# EAGLE schematic threshold_control_device (EAGLE 6.2)
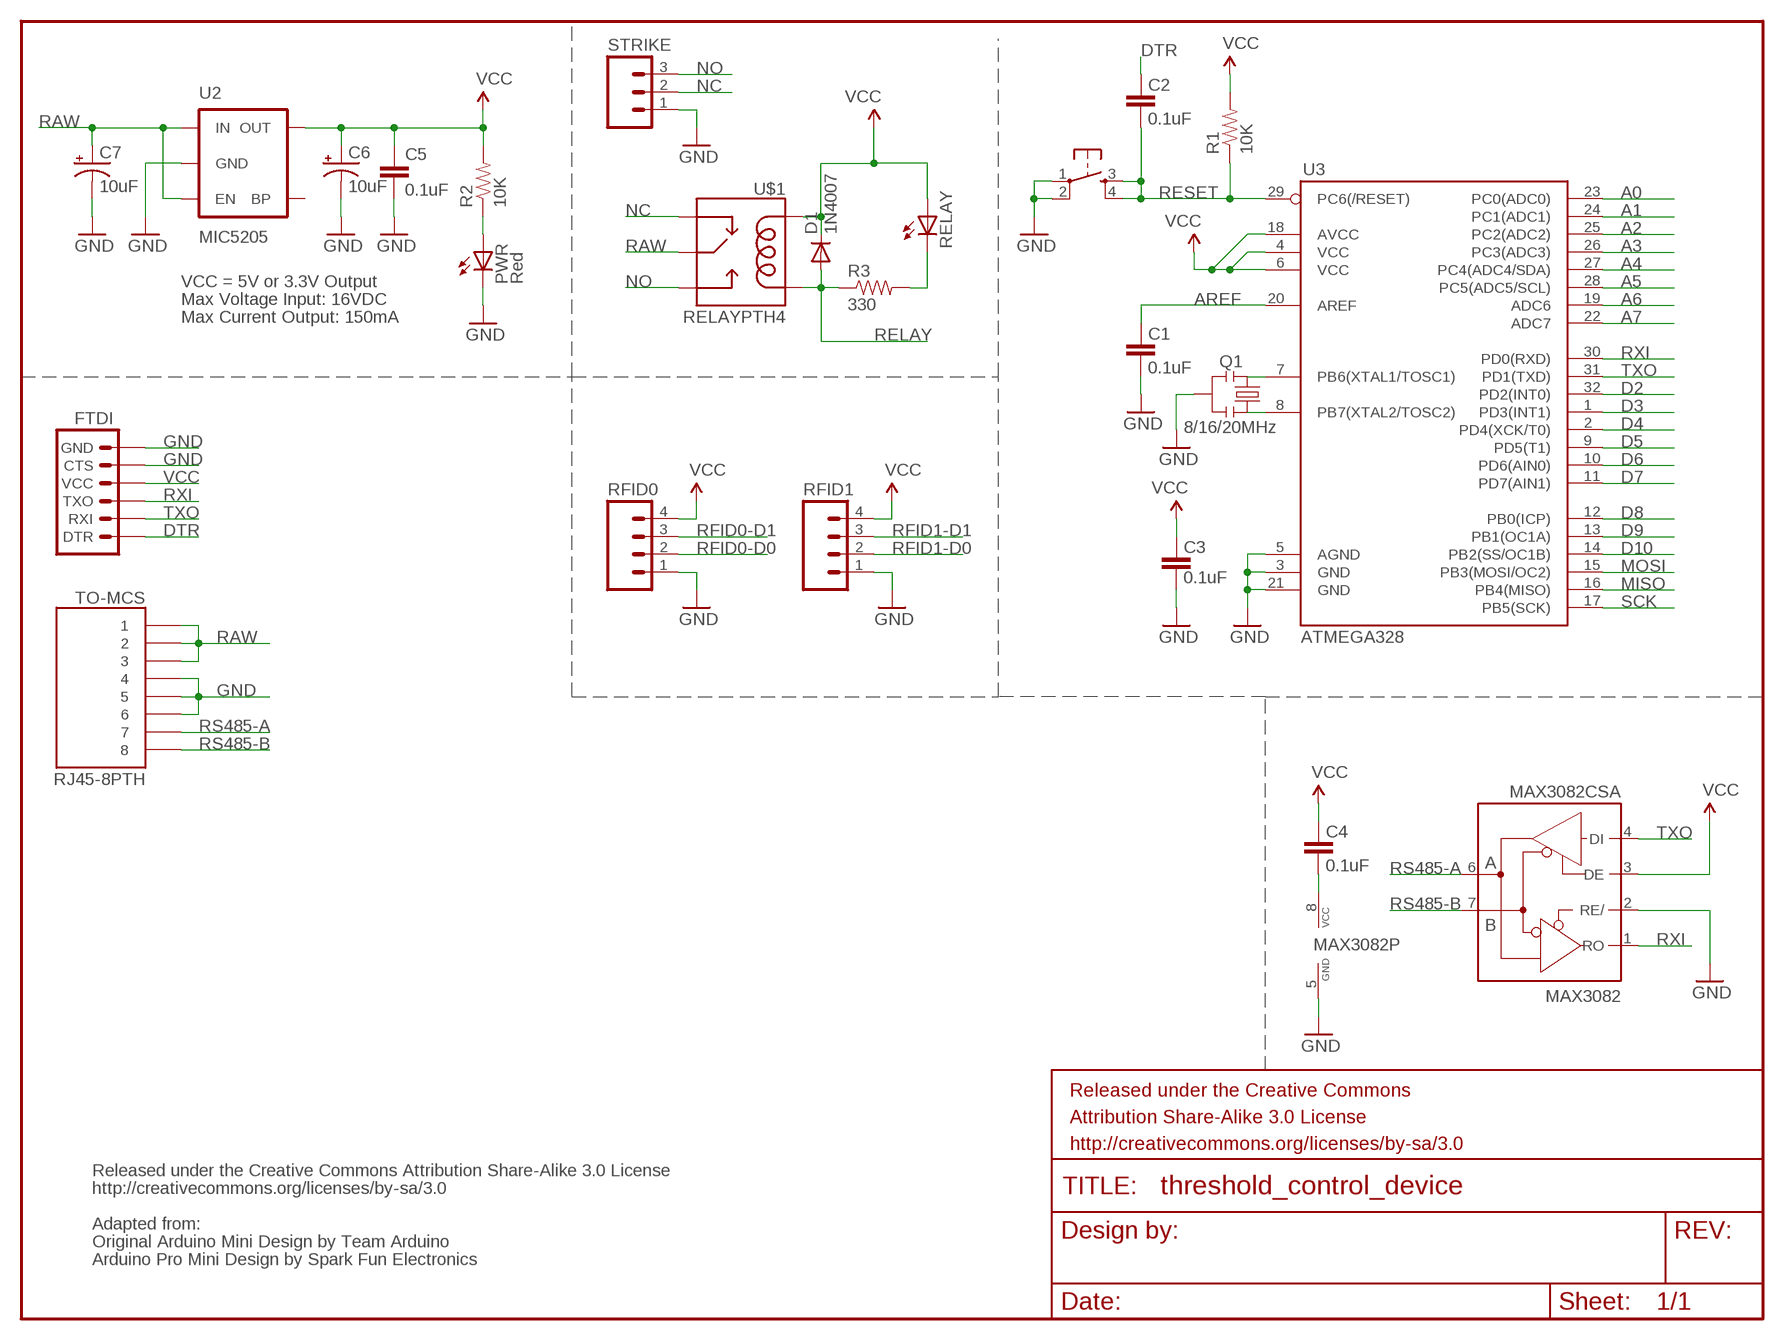
[diagram p0: schematic, sheet 1]

## Parts
C1  0.1uF  CAP0402-CAP  [0402-CAP]
C2  0.1uF  CAP0402-CAP  [0402-CAP]
C3  0.1uF  CAP0402-CAP  [0402-CAP]
C4  0.1uF  CAP0402-CAP  [0402-CAP]
C5  0.1uF  CAP0402-CAP  [0402-CAP]
C6  10uF  CAP_POL1206  [EIA3216]
C7  10uF  CAP_POL1206  [EIA3216]
D1  1N4007  DIODEPTH  [DIODE-1N4001]
FRAME1  FRAME-LETTER  [CREATIVE_COMMONS]
FTDI  ARDUINO_SERIAL_PROGRAMSMD  [1X06-SMD]
MAX3082  MAX3082CSA  MAX481CSA  [SO08]
PWR  Red  LED0603  [LED-0603]
Q1  8/16/20MHz  RESONATORSMD  [RESONATOR-SMD]
R1  10K  RESISTOR0402-RES  [0402-RES]
R2  10K  RESISTOR0402-RES  [0402-RES]
R3  330  RESISTORPTH-1/4W  [AXIAL-0.4]
RELAY  LED5MM  [LED5MM]
RESET  Reset  TAC_SWITCHSMD  [TACTILE_SWITCH_SMD]
RFID0  M04SCREW  [SCREWTERMINAL-3.5MM-4]
RFID1  M04SCREW  [SCREWTERMINAL-3.5MM-4]
STRIKE  M03SCREW  [SCREWTERMINAL-3.5MM-3]
TO-MCS  RJ45-8PTH  [RJ45-8]
U2  MIC5205  V_REG_LDOSMD  [SOT23-5]
U3  ATMEGA328  ATMEGA168  [TQFP32-08]
U$1  RELAYPTH4  [RELAY-JZC]

## Nets
A0: U3.23(PC0(ADC0))
A1: U3.24(PC1(ADC1))
A2: U3.25(PC2(ADC2))
A3: U3.26(PC3(ADC3))
A4: U3.27(PC4(ADC4/SDA))
A5: U3.28(PC5(ADC5/SCL))
A6: U3.19(ADC6)
A7: U3.22(ADC7)
AREF: C1.2 U3.20(AREF)
D2: U3.32(PD2(INT0))
D3: U3.1(PD3(INT1))
D4: U3.2(PD4(XCK/T0))
D5: U3.9(PD5(T1))
D6: U3.10(PD6(AIN0))
D7: U3.11(PD7(AIN1))
D8: U3.12(PB0(ICP))
D9: U3.13(PB1(OC1A))
D10: U3.14(PB2(SS/OC1B))
DTR: C2.2 FTDI.1(DTR)
GND [vcc]: C1.1 C3.1 C5.2 C6.C(-) C7.C(-) FTDI.5(CTS) FTDI.6(GND) MAX3082.2(RE/) MAX3082.5(GND) PWR.C Q1.2 RESET.1 RESET.2 RFID0.1 RFID1.1 STRIKE.1 TO-MCS.4 TO-MCS.5 TO-MCS.6 U2.2(GND) U3.3(GND) U3.5(AGND) U3.21(GND)
MISO: U3.16(PB4(MISO))
MOSI: U3.15(PB3(MOSI/OC2))
N$1: Q1.1 U3.8(PB7(XTAL2/TOSC2))
N$2: Q1.3 U3.7(PB6(XTAL1/TOSC1))
N$3: C4.1 MAX3082.8(VCC)
N$4: R3.P$2 RELAY.K(C)
N$38: PWR.A R2.1
NC: STRIKE.2 U$1.2(NC)
NO: STRIKE.3 U$1.3(NO)
RAW [vcc]: C7.A(+) TO-MCS.1 TO-MCS.2 TO-MCS.3 U2.1(IN) U2.3(EN) U$1.4(MAIN)
RELAY: D1.A R3.P$1 U$1.1(COIL2)
RESET: C2.1 R1.1 RESET.3 RESET.4 U3.29(PC6(/RESET))
RFID0-D0: RFID0.2
RFID0-D1: RFID0.3
RFID1-D0: RFID1.2
RFID1-D1: RFID1.3
RS485-A: MAX3082.6(A) TO-MCS.7
RS485-B: MAX3082.7(B) TO-MCS.8
RXI: FTDI.3(TXO) MAX3082.1(RO) U3.30(PD0(RXD))
SCK: U3.17(PB5(SCK))
TXO: FTDI.2(RXI) MAX3082.4(DI) U3.31(PD1(TXD))
VCC: C3.2 C4.2 C5.1 C6.A(+) D1.C FTDI.4(VCC) MAX3082.3(DE) R1.2 R2.2 RELAY.A RFID0.4 RFID1.4 U2.5(OUT) U3.4(VCC) U3.6(VCC) U3.18(AVCC) U$1.5(COIL1)
Unconnected: U2.4(BP)

## Notes on the sheet
- VCC = 5V or 3.3V Output
- Max Voltage Input: 16VDC
- Max Current Output: 150mA
- Released under the Creative Commons Attribution Share-Alike 3.0 License
- http://creativecommons.org/licenses/by-sa/3.0
- Adapted from:
- Original Arduino Mini Design by Team Arduino
- Arduino Pro Mini Design by Spark Fun Electronics

## Library data of the parts
C1-C5 = SparkFun:CAP: Capacitor Standard 0603 ceramic capacitor, and 0.1" leaded capacitor.
C6 C7 = SparkFun:CAP_POL: Capacitor Polarized These are standard SMD and PTH capacitors. Normally 10uF, 47uF, and 100uF in electrolytic and tantalum varieties. Always verify the external diameter of the through hole cap, it varies with capacity, voltage, and manufacturer. The EIA devices should be standard.
D1 = SparkFun:DIODE: Diode These are standard reverse protection diodes and small signal diodes. SMA package can handle up to about 1A. SOD-323 can handle about 200mA. What the SOD-323 package when ordering, there are some mfgs out there that are 5-pin packages.
FRAME1 = SparkFun-Aesthetics:FRAME-LETTER: Schematic Frame Standard 8.5x11 US Letter frame
FTDI = SparkFun-Connectors:ARDUINO_SERIAL_PROGRAM: FTDI connector footprints
MAX3082 = maxim:MAX481CSA: RS485 TRANSEIVER; MF: MAXIM; MPN: MAX481CSA; OC_FARNELL: unknown; OC_NEWARK: 90C3817
PWR RELAY = SparkFun:LED: LEDs Standard schematic elements and footprints for 5mm, 3mm, 1206, and 0603 sized LEDs. 5mm - Spark Fun Electronics SKU : COM-00529 (and others)
Q1 = SparkFun:RESONATOR: Resonator Small SMD resonator. This is the itty bitty 10/20MHz resonators with built in caps. CSTCE10M0G55 and CSTCE20M0V53. Footprint has been reviewed closely but hasn't been tested yet.
R1-R3 = SparkFun:RESISTOR: Resistor Basic schematic elements and footprints for 0603, 1206, and PTH resistors.
RESET = SparkFun:TAC_SWITCH: Momentary Switch Button commonly used for reset or general input. Spark Fun Electronics SKU : COM-00097
RFID0 RFID1 = SparkFun-Connectors:M04: Header 4 Standard 4-pin 0.1" header. Use with straight break away headers (SKU : PRT-00116), right angle break away headers (PRT-00553), swiss pins (PRT-00743), machine pins (PRT-00117), and female headers (PRT-00115). Molex polarized connector foot print use with SKU : PRT-08231 with associated crimp pins and housings. 1MM SMD Version SKU: PRT-10208
STRIKE = SparkFun-Connectors:M03: Header 3 Standard 3-pin 0.1" header. Use with straight break away headers (SKU : PRT-00116), right angle break away headers (PRT-00553), swiss pins (PRT-00743), machine pins (PRT-00117), and female headers (PRT-00115). Molex polarized connector foot print use with SKU : PRT-08232 with associated crimp pins and housings.
TO-MCS = SparkFun:RJ45-8: RJ45 Jack Simple RJ45, 8-pin connection - connector for common Cat5, Cat5e, and Cat6 Ethernet cables. Footprint not yet proven in production. Connector sku is PRT-00643; Breakout PCB sku is BOB-00716.
U2 = SparkFun:V_REG_LDO: Voltage Regulator LDO Standard 150mA LDO voltage regulator in SOT-23 layout. Micrel part MIC5205. BP (by-pass) pin is used to lower output noise with 470pF cap.
U3 = SparkFun:ATMEGA168
U$1 = SparkFun-Electromechanical:RELAY: SPDT relay (COM-00101)

## Net classes
0 default: width 0.203 mm
1 vcc: width 0.254 mm